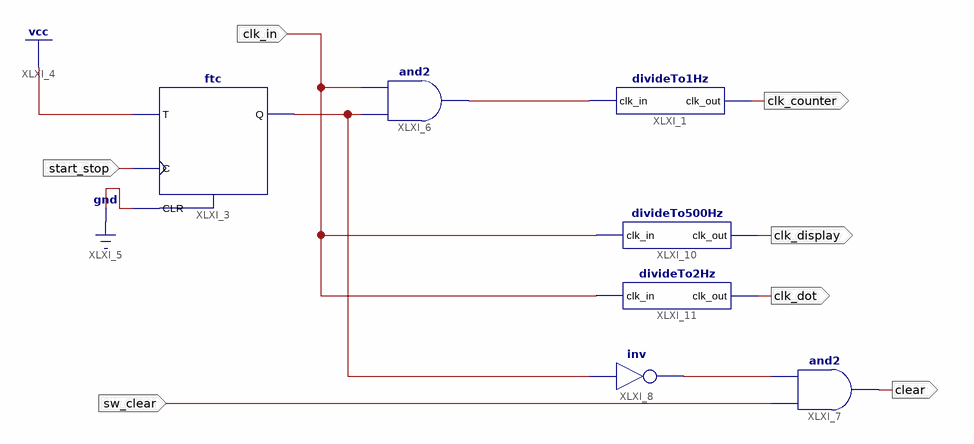
[diagram p0: schematic sheet 1]
// Xilinx ISE schematic control.sch (spartan6) as structural Verilog: 7 symbols, 7 ports
module control (
  input  start_stop,
  input  clk_in,
  input  sw_clear,
  output clk_counter,
  output clk_display,
  output clear,
  output clk_dot
);

  wire XLXN_8, XLXN_16, XLXN_17;

  divideTo1Hz XLXI_1 (.clk_in(XLXN_8), .clk_out(clk_counter));
  ftc XLXI_3 (.C(start_stop), .CLR(1'b0), .T(1'b1), .Q(XLXN_16));
  and XLXI_6 (XLXN_8, XLXN_16, clk_in);
  and XLXI_7 (clear, sw_clear, XLXN_17);
  not XLXI_8 (XLXN_17, XLXN_16);
  divideTo500Hz XLXI_10 (.clk_in(clk_in), .clk_out(clk_display));
  divideTo2Hz XLXI_11 (.clk_in(clk_in), .clk_out(clk_dot));
endmodule
